# EAGLE design MGB-001-IO (EAGLE 9.6.2)

## Sheet 1 of 3: GPIO
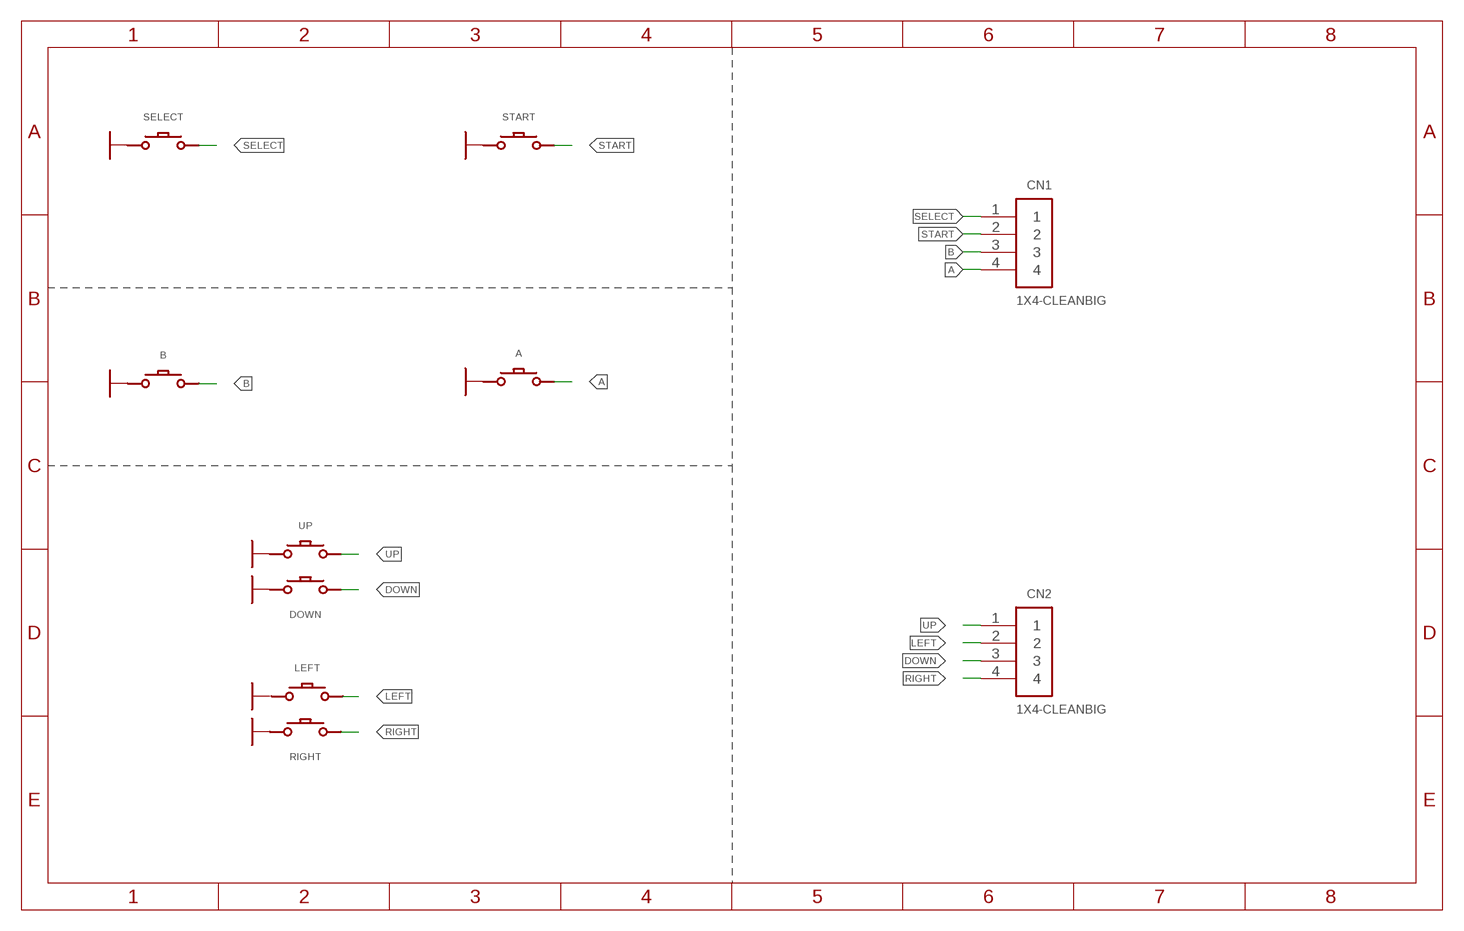
[diagram p0: schematic, sheet 1]

### Parts
A  CONDUCTIVE_BUTTONCONDUCTIVE_BUTTON_THICK  [CONDUCTIVE_BUTTON_THICK]
B  CONDUCTIVE_BUTTONCONDUCTIVE_BUTTON_THICK  [CONDUCTIVE_BUTTON_THICK]
CN1  1X4-CLEANBIG  [1X04-CLEANBIG]
CN2  1X4-CLEANBIG  [1X04-CLEANBIG]
DOWN  CONDUCTIVE_BUTTONCONDUCTIVE_BUTTON_DIRECTIONAL_THICK  [CONDUCTIVE_BUTTON_DIRECTIONAL_THICK]
LEFT  CONDUCTIVE_BUTTONCONDUCTIVE_BUTTON_DIRECTIONAL_THICK  [CONDUCTIVE_BUTTON_DIRECTIONAL_THICK]
RIGHT  CONDUCTIVE_BUTTONCONDUCTIVE_BUTTON_DIRECTIONAL_THICK  [CONDUCTIVE_BUTTON_DIRECTIONAL_THICK]
SELECT  CONDUCTIVE_BUTTON_STARTSELECTCONDUCTIVE_BUTTON_THICK_STARTSELECT  [CONDUCTIVE_BUTTON_THICK_STARTSELECT]
START  CONDUCTIVE_BUTTON_STARTSELECTCONDUCTIVE_BUTTON_THICK_STARTSELECT  [CONDUCTIVE_BUTTON_THICK_STARTSELECT]
UP  CONDUCTIVE_BUTTONCONDUCTIVE_BUTTON_DIRECTIONAL_THICK  [CONDUCTIVE_BUTTON_DIRECTIONAL_THICK]

### Nets
A: A.P$ACTIVE CN1.4
B: B.P$ACTIVE CN1.3
DOWN: CN2.3 DOWN.P$ACTIVE
GND: A.P$GND B.P$GND DOWN.P$GND RIGHT.P$GND SELECT.P$GND SELECT.P$GND1(P$GND) SELECT.P$GND2(P$GND) SELECT.P$GND3(P$GND) START.P$GND START.P$GND1(P$GND) START.P$GND2(P$GND) START.P$GND3(P$GND) UP.P$GND ; also sheet 2
LEFT: CN2.2 LEFT.P$ACTIVE
RIGHT: CN2.4 RIGHT.P$ACTIVE
SELECT: CN1.1 SELECT.P$ACTIVE SELECT.P$ACTIVE1(P$ACTIVE) SELECT.P$ACTIVE2(P$ACTIVE) SELECT.P$ACTIVE3(P$ACTIVE) SELECT.P$ACTIVE4(P$ACTIVE) SELECT.P$ACTIVE5(P$ACTIVE) SELECT.P$ACTIVE6(P$ACTIVE)
START: CN1.2 START.P$ACTIVE START.P$ACTIVE1(P$ACTIVE) START.P$ACTIVE2(P$ACTIVE) START.P$ACTIVE3(P$ACTIVE) START.P$ACTIVE4(P$ACTIVE) START.P$ACTIVE5(P$ACTIVE) START.P$ACTIVE6(P$ACTIVE)
UP: CN2.1 UP.P$ACTIVE
Unconnected: LEFT.P$GND

## Sheet 2 of 3: AUDIO
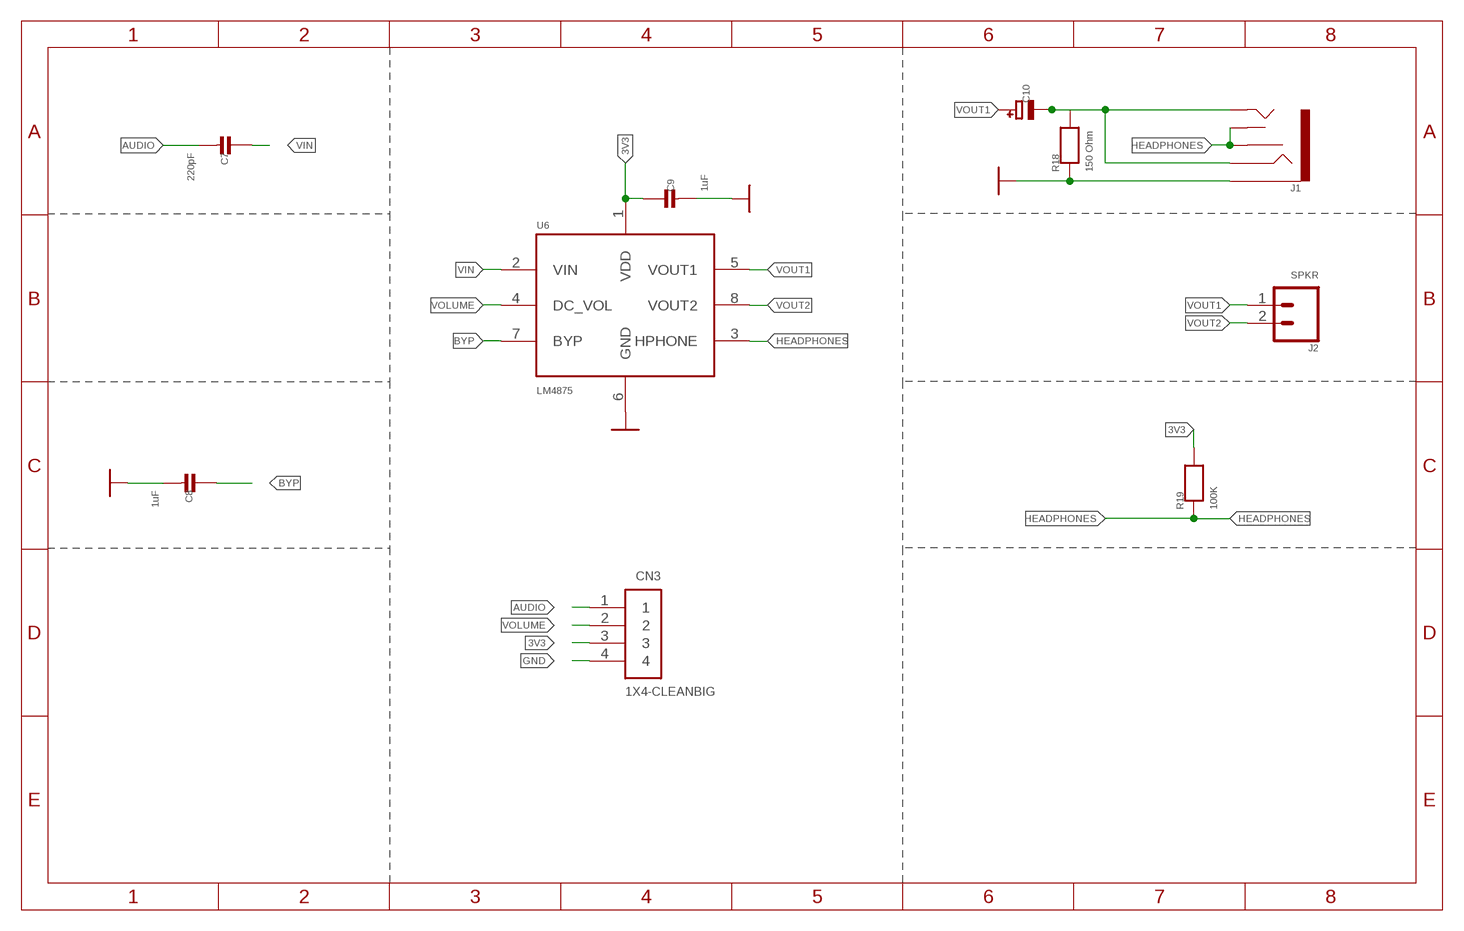
[diagram p1: schematic, sheet 2]

### Parts
C7  220pF  CAP_CERAMIC  [0603-MINI-CAP]
C8  1uF  CAP_CERAMIC  [0603-MINI-CAP]
C9  1uF  CAP_CERAMIC  [0603-MINI-CAP]
C10  100uF  CAP_TANTALUMA/3216_WAVE  [EIA3216-18/A-W]
CN3  1X4-CLEANBIG  [1X04-CLEANBIG]
J1  AUDIO_JACK_3.5MM_KIT  [AUDIO-JACK-KIT]
J2  SPKR  CONN_02  [1X02]
R18  150 Ohm  RESISTOR0603MINI  [0603-MINI]
R19  100K  RESISTOR0603MINI  [0603-MINI]
U6  LM4875  [SOIC8]

### Nets
3V3: C9.1 CN3.3 R19.2 U6.1(VDD)
AUDIO: C7.2 CN3.1
BYP: C8.1 U6.7(BYP)
GND: C8.2 C9.2 CN3.4 J1.SLEEVE R18.1 U6.6(GND) ; also sheet 1
HEADPHONES: J1.RSH J1.TSH R19.1 U6.3(HPHONE)
VIN: C7.1 U6.2(VIN)
VIN1: C10.- J1.RING J1.TIP R18.2
VOLUME: CN3.2 U6.4(DC_VOL)
VOUT1: C10.+ J2.1 U6.5(VOUT1)
VOUT2: J2.2 U6.8(VOUT2)

## Sheet 3 of 3: Board and Logos
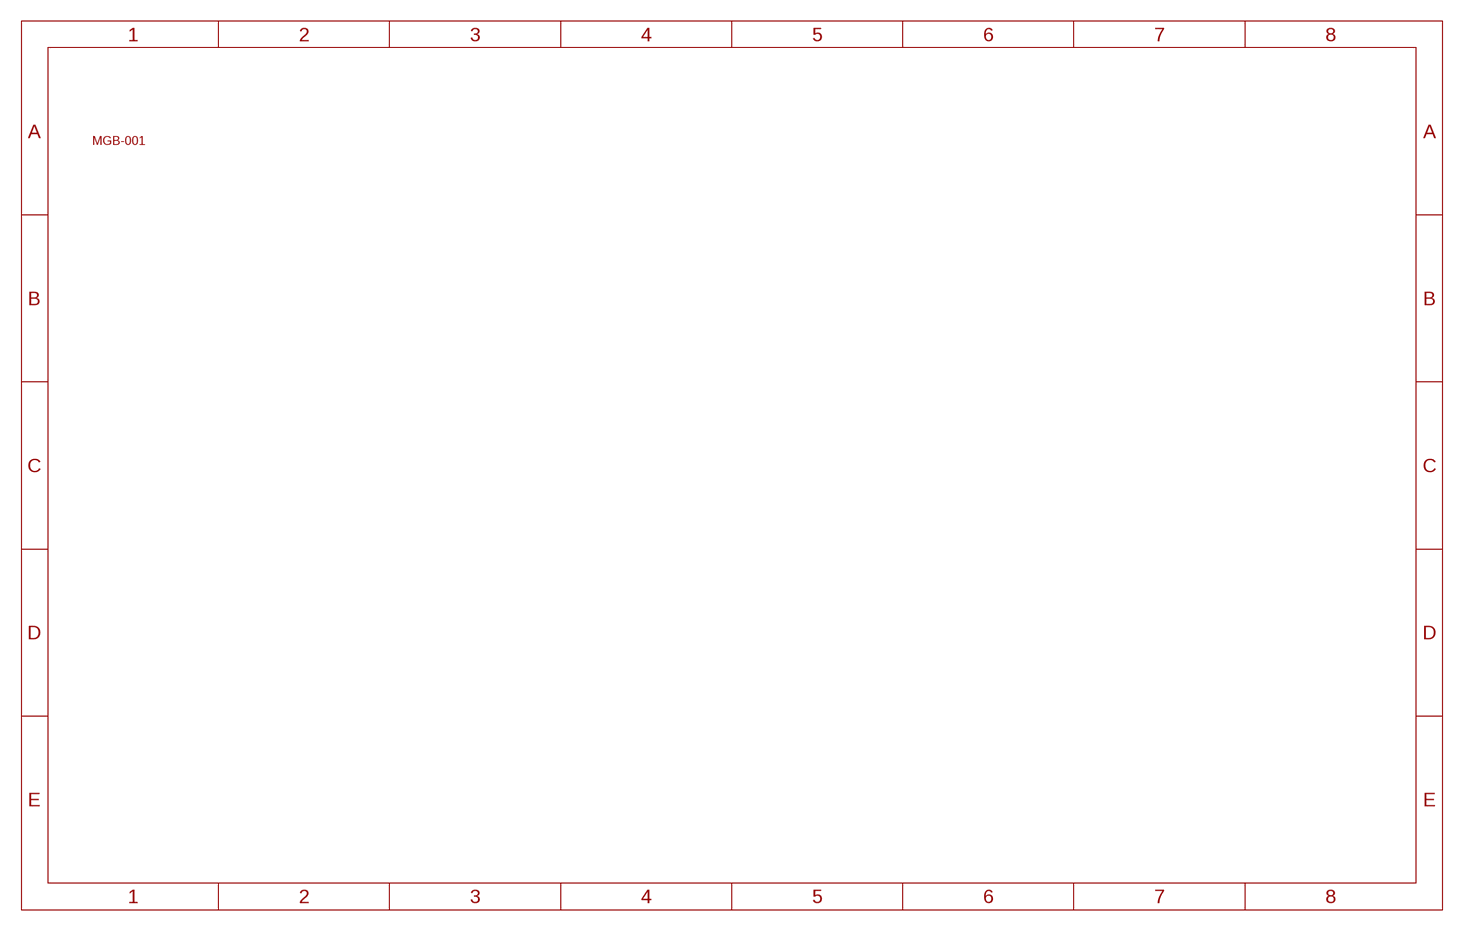
[diagram p2: schematic, sheet 3]

### Parts
U$17  MGB-001MGB-001-IO  [MGB-001-IO]

## Library data of the parts
A B DOWN LEFT RIGHT UP = RetroESP32:CONDUCTIVE_BUTTON; IGNORE_BOM: TRUE
C7 = RetroESP32:CAP_CERAMIC: Ceramic Capacitors For new designs, use the packages preceded by an '_' character since they are more reliable: The following footprints should be used on most boards: _0402 - Standard footprint for regular board layouts _0603 - Standard footprint for regular board layouts _0805 - Standard footprint for regular board layouts _1206 - Standard footprint for regular board layouts For extremely tight-pitch boards where space is at a premium, the following 'micro-pitch' footprints can be used (smaller pads, no silkscreen outline, etc.): _0402MP - Micro-pitch footprint for very dense/compact boards _0603MP - Micro-pitch footprint for very dense/compact boards _0805MP - Micro-pitch footprint for very dense/compact boards _1206MP - Micro-pitch footprint for very dense/compact boards; MPN: CL10C221JB8NNNC
C8 C9 = RetroESP32:CAP_CERAMIC: Ceramic Capacitors For new designs, use the packages preceded by an '_' character since they are more reliable: The following footprints should be used on most boards: _0402 - Standard footprint for regular board layouts _0603 - Standard footprint for regular board layouts _0805 - Standard footprint for regular board layouts _1206 - Standard footprint for regular board layouts For extremely tight-pitch boards where space is at a premium, the following 'micro-pitch' footprints can be used (smaller pads, no silkscreen outline, etc.): _0402MP - Micro-pitch footprint for very dense/compact boards _0603MP - Micro-pitch footprint for very dense/compact boards _0805MP - Micro-pitch footprint for very dense/compact boards _1206MP - Micro-pitch footprint for very dense/compact boards; MPN: CL10A105KP8NNNC
C10 = RetroESP32:CAP_TANTALUM: Tantalum Capacitors Wave footprints have larger pads and are meant to be used for hand soldering. Reflow footprints are optimised for solder paste and a reflow oven. EIA3216-18/A-[R/W] - Size A / 3216-18 / 1206 footprint 4.7µF 25V 10% Tantalum Capacitor 10µF 16V 10% Tantalum Capacitor [Digikey: 495-2236-2-ND] EIA3528-21/B-[R/W] - Size B / 3528-21 47µF 10V 10% Tantalum Capactior [Digikey: 495-2216-1-ND] EIA6032-28/C-[R/W] - Size C / 6032-28 10µF 35V 20% Tantalum Capacitor [Digikey: 495-2285-1-ND] 100µF 16V 10% Tantalum Capactior [Digikey: 399-5214-1-ND]; MPN: F930J107KAA
CN1-CN3 = adafruit:1X4: 4-pin connector
J1 = RetroESP32:AUDIO_JACK_3.5MM: Audio Jack 3.5mm variants of PTH and SMT stereo audio jack with bypass switches. SparkFun Products: SparkFun SparkPunk Sound Kit <[https://www.sparkfun.com/products/11177]> - PTH MP3 Trigger <https://www.sparkfun.com/products/13720> -3.5mm SMD SparkFun PicoBoard <https://www.sparkfun.com/products/11888>- 2.5mm SMD; MPN: SJ1-3525NG-GR; PROD_ID: CONN-10353; SF_ID: PRT-08032
J2 = RetroESP32:CONN_02: Multi connection point. Often used as Generic Header-pin footprint for 0.1 inch spaced/style header connections On any of the 0.1 inch spaced packages, you can populate with these: Break Away Headers - Straight <https://www.sparkfun.com/products/116> (PRT-00116) Break Away Male Headers - Right Angle <https://www.sparkfun.com/products/553> (PRT-00553) Female Headers <https://www.sparkfun.com/products/115> (PRT-00115) Break Away Headers - Machine Pin <https://www.sparkfun.com/products/117> (PRT-00117) Break Away Female Headers - Swiss Machine Pin <https://www.sparkfun.com/products/743> (PRT-00743) For SCREWTERMINALS and SPRING TERMINALS visit here: Screw Terimnals on SparkFun.com <https://www.sparkfun.com/search/results?term=Screw+Terminals> (5mm/3.5mm/2.54mm spacing) This device is also useful as a general connection point to wire up your design to another part of your project. Our various solder wires solder well into these plated through hole pads. Hook-Up Wire - Assortment (Stranded, 22 AWG) <https://www.sparkfun.com/products/11375> (PRT-11375) Hook-Up Wire - Assortment (Solid Core, 22 AWG) <https://www.sparkfun.com/products/11367> (PRT-11367) View the entire wire category on our website here <https://www.sparkfun.com/categories/141> Special notes: Molex polarized connector foot print use with: PRT-08233 with associated crimp pins and housings. 2.54_SCREWTERM for use with PRT-10571. 3.5mm Screw Terminal footprints for PRT-08084 5mm Screw Terminal footprints for use with PRT-08432; PROD_ID: CONN-13512; SF_ID: PRT-09918; SF_SKU: PRT-08432; SKU: PRT-09914
R18 = RetroESP32:RESISTOR: Resistors For new designs, use the packages preceded by an '_' character since they are more reliable: The following footprints should be used on most boards: _0402 - Standard footprint for regular board layouts _0603 - Standard footprint for regular board layouts _0805 - Standard footprint for regular board layouts _1206 - Standard footprint for regular board layouts For extremely tight-pitch boards where space is at a premium, the following 'micro-pitch' footprints can be used (smaller pads, no silkscreen outline, etc.): _0402MP - Micro-pitch footprint for very dense/compact boards _0603MP - Micro-pitch footprint for very dense/compact boards _0805MP - Micro-pitch footprint for very dense/compact boards _1206MP - Micro-pitch footprint for very dense/compact boards; MPN: ERJ-PA3J151V
R19 = RetroESP32:RESISTOR: Resistors For new designs, use the packages preceded by an '_' character since they are more reliable: The following footprints should be used on most boards: _0402 - Standard footprint for regular board layouts _0603 - Standard footprint for regular board layouts _0805 - Standard footprint for regular board layouts _1206 - Standard footprint for regular board layouts For extremely tight-pitch boards where space is at a premium, the following 'micro-pitch' footprints can be used (smaller pads, no silkscreen outline, etc.): _0402MP - Micro-pitch footprint for very dense/compact boards _0603MP - Micro-pitch footprint for very dense/compact boards _0805MP - Micro-pitch footprint for very dense/compact boards _1206MP - Micro-pitch footprint for very dense/compact boards; MPN: ERJ-PA3J104V
SELECT START = RetroESP32:CONDUCTIVE_BUTTON_STARTSELECT; IGNORE_BOM: TRUE
U6 = RetroESP32:LM4875; MPN: LM4875MX/NOPB
U$17 = RetroESP32:MGB-001: MGB-001 Game Boy Pocket This is the footprint and dimensions outline for the Game Boy Pocket PCB Variants MGB-001 - Standard Game Boy Pocket MGB-001-ESP32 - Game Boy Pocket w/ Antenna Cut Out

## Board
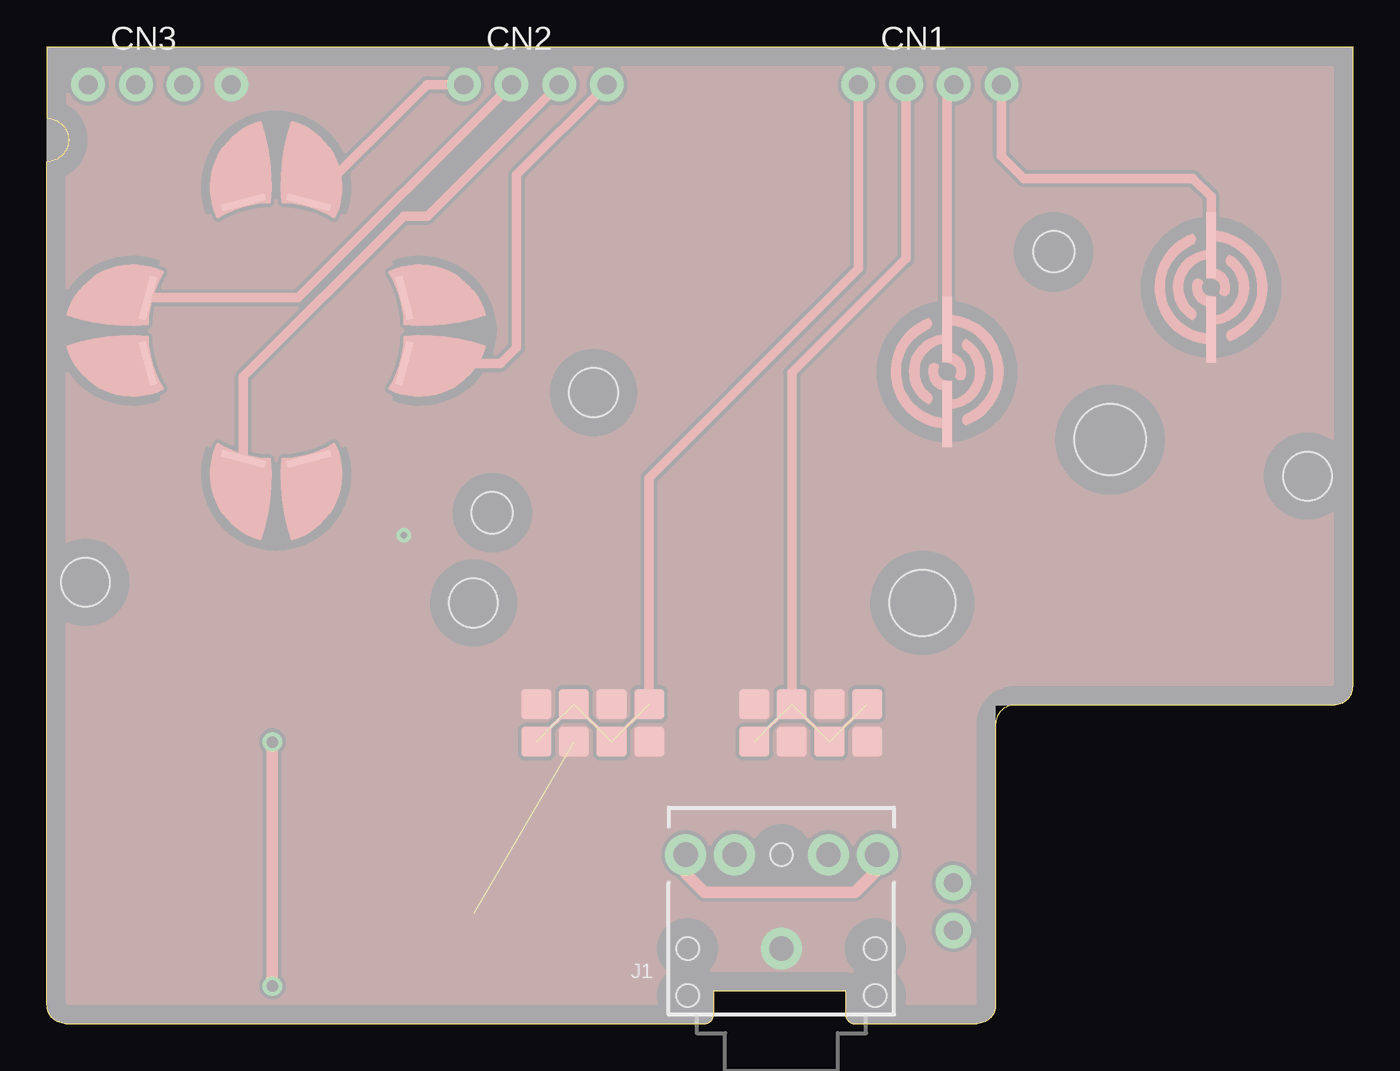
[diagram p3: board, top side]
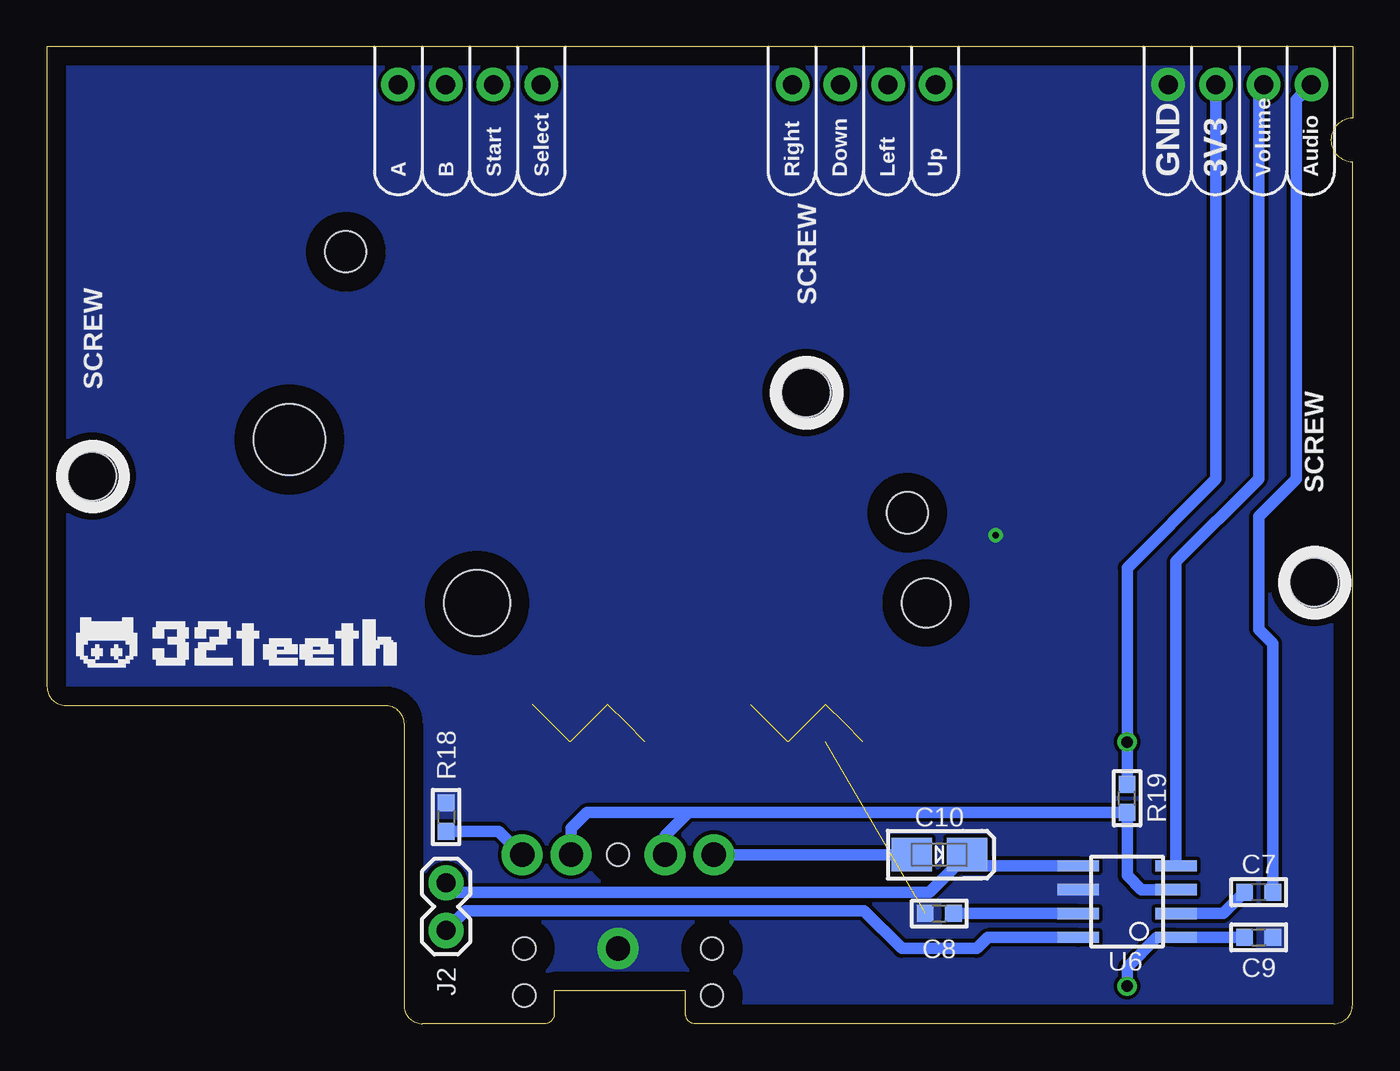
[diagram p4: board, bottom side, seen from below]

Size 69.5 x 52 mm. Coordinates in mm from the lower left corner, seen from the top.
Copper layers (1*16): Top 0.035mm / dielectric 1mm / Bottom 0.035mm
Design rules "default *": minimum track width 10mil, minimum drill 24mil, track to track 8mil, track to pad 8mil, pad to pad 8mil, via to via 8mil, smd to smd 8mil, copper to edge 40mil, drill to drill 8mil, minimum pad ring 10mil, minimum via ring 8mil, stop-mask expansion 5mil, vias tented up to drill 10mil, thermal gap 10mil

### Footprints (pad centres in the part's own frame; a part is rotated, then mirrored left to right if it is on the bottom)
CONDUCTIVE_BUTTON_THICK = smd 0.5 x 3.5: P$ACTIVE 0,-2.25; P$GND 0,2.25
0603-MINI-CAP = smd 0.9 x 0.9: 1 -0.75,0; 2 0.75,0
EIA3216-18/A-W = smd 2.15 x 1.8: + 1.475,0; - -1.475,0
1X04-CLEANBIG = drill 1.016 pad 1.778: 1 -3.81,0; 2 -1.27,0; 3 1.27,0; 4 3.81,0
CONDUCTIVE_BUTTON_DIRECTIONAL_THICK = smd 2.4 x 0.4 rotated 75: P$ACTIVE 0.875,1.75 | smd 2.4 x 0.4 rotated 285: P$GND 0.875,-1.75
AUDIO-JACK-KIT = drill 1.3 pad 2.184: RING 5,5.1; RSH 5,2.5; SLEEVE 0,0; TIP 5,-5.1; TSH 5,-2.5 | hole 1.2: 0,5; -2.5,5; -2.5,-5; 0,-5; 5,0
1X02 = drill 1.016 pad 1.88: 1 0,0; 2 2.54,0
0603-MINI = smd 0.9 x 0.9: 1 -0.75,0; 2 0.75,0
CONDUCTIVE_BUTTON_THICK_STARTSELECT = smd 1.6 x 1.6: P$ACTIVE 3,1; P$ACTIVE1 -1,1; P$ACTIVE2 -3,-1; P$ACTIVE3 1,-1; P$GND 1,1; P$GND1 -3,1; P$GND2 -1,-1; P$GND3 3,-1 | smd 2.54 x 0.185 rotated 45: P$ACTIVE4 -2,0 | smd 2.54 x 0.185 rotated 135: P$ACTIVE5 0,0 | smd 2.54 x 0.185 rotated 225: P$ACTIVE6 2,0
SOIC8 = smd 0.6 x 2.2: 1 -1.905,-2.6; 2 -0.635,-2.6; 3 0.635,-2.6; 4 1.905,-2.6; 5 1.905,2.6; 6 0.635,2.6; 7 -0.635,2.6; 8 -1.905,2.6
MGB-001-IO = hole 2.6: 67.1,29.15; 29.1,33.6; 22.7,22.4; 2.05,23.5 | hole 3.8: 56.6,31.1 | hole 2.2: 53.6,41.1; 23.7,27.2 | hole 3.5: 46.6,22.4

### Placement (x,y rotation side)
A  61.97,39.2 180 top
B  47.92,34.71 180 top
C7  5,7 0 bottom
C8  22,5.87 180 bottom
C9  5,4.59 0 bottom
C10  22,9 0 bottom
CN1  47,50 0 top
CN2  26,50 0 top
CN3  6,50 0 top
DOWN  12.2,29.2 90 top
J1  39.1,4 90 top
J2  48.25,7.5 270 bottom
LEFT  4.5,36.9 0 top
R18  48.25,11 270 bottom
R19  12,12 90 bottom
RIGHT  19.9,36.9 180 top
SELECT  29.05,16.01 0 top
START  40.66,16.01 0 top
U6  12,6.5 90 bottom
U$17  0,0 0 top
UP  12.2,44.6 270 top

### Tracks (layer width: path | path; a pad name or v marks a point on that pad's centre or on a via)
3V3  (via drill 0.61)
  Top 0.61: v12,2 v12,15
  Bottom 0.61: C9.1 U6.1 10.4,4.59 12,3 v12,2 | CN3.3 7.27,29 12,24.27 v12,15 R19.2
A
  Top 0.508: A.P$ACTIVE 61.97,44.03 61,45 52,45 50.81,46.19 CN1.4
AUDIO
  Bottom 0.61: C7.2 4.25,20.25 5,21 5,27 3,29 3,49.19 CN3.1
B
  Top 0.508: B.P$ACTIVE 47.92,49.65 CN1.3
BYP
  Bottom 0.61: U6.7 C8.1
DOWN
  Top 0.508: DOWN.P$ACTIVE 10.45,34.45 19,43 20.27,43 CN2.3
GND  (via drill 0.35)  (1 unrouted)
  other vias: 19,26
  pour Bottom (rank 6, no thermals): 0,0 1,0 17,0 35.5,0 35.5,1.75 42.5,1.75 42.5,0 50.5,0 50.5,16.95 69.5,16.95 69.5,52 0,52
  pour Top (rank 2, no thermals): 0,0 1,0 17,0 35.5,0 35.5,1.75 42.5,1.75 42.5,0 50.5,0 50.5,16.95 69.5,16.95 69.5,52 0,52
HEADPHONES
  Bottom 0.61: U6.3 11.25,7.13 12,7.88 R19.1 35.35,11.25 | J1.RSH 36.6,10 35.35,11.25 | 35.35,11.25 40.75,11.25 41.6,10.4 J1.TSH
LEFT
  Top 0.508: LEFT.P$ACTIVE 13.38,38.65 CN2.2
RIGHT
  Top 0.508: RIGHT.P$ACTIVE 24.15,35.15 25,36 25,45.19 CN2.4
SELECT  (6 unrouted)
  Top 0.508: CN1.1 43.19,40.19 32.05,29.05 SELECT.P$ACTIVE
START  (6 unrouted)
  Top 0.508: CN1.2 45.73,40.73 39.66,34.66 START.P$ACTIVE1
UP
  Top 0.508: UP.P$ACTIVE 20.23,50 CN2.1
VIN
  Bottom 0.61: U6.2 6.88,5.87 C7.1
VIN1
  Top 0.61: J1.TIP 44.2,8.2 43,7 35,7 34,8 J1.RING
  Bottom 0.61: C10.- J1.RING | J1.TIP 45.45,10.25 R18.2
VOLUME
  Bottom 0.61: CN3.2 5,49.73 5,29 9.4,24.6 U6.4
VOUT1
  Bottom 0.61: U6.5 19.93,8.4 C10.+ 22.52,7 47.75,7 J2.1
VOUT2
  Bottom 0.61: U6.8 19.41,4.59 20,4 24,4 26,6 47.21,6 J2.2

### Text on the board
bPlace: Audio | Volume | 3V3 | GND | Up | Left | Down | Right | Select | Start | B | A